# Altium schematic sheet VCO_Esquematico.SchDoc
size A4
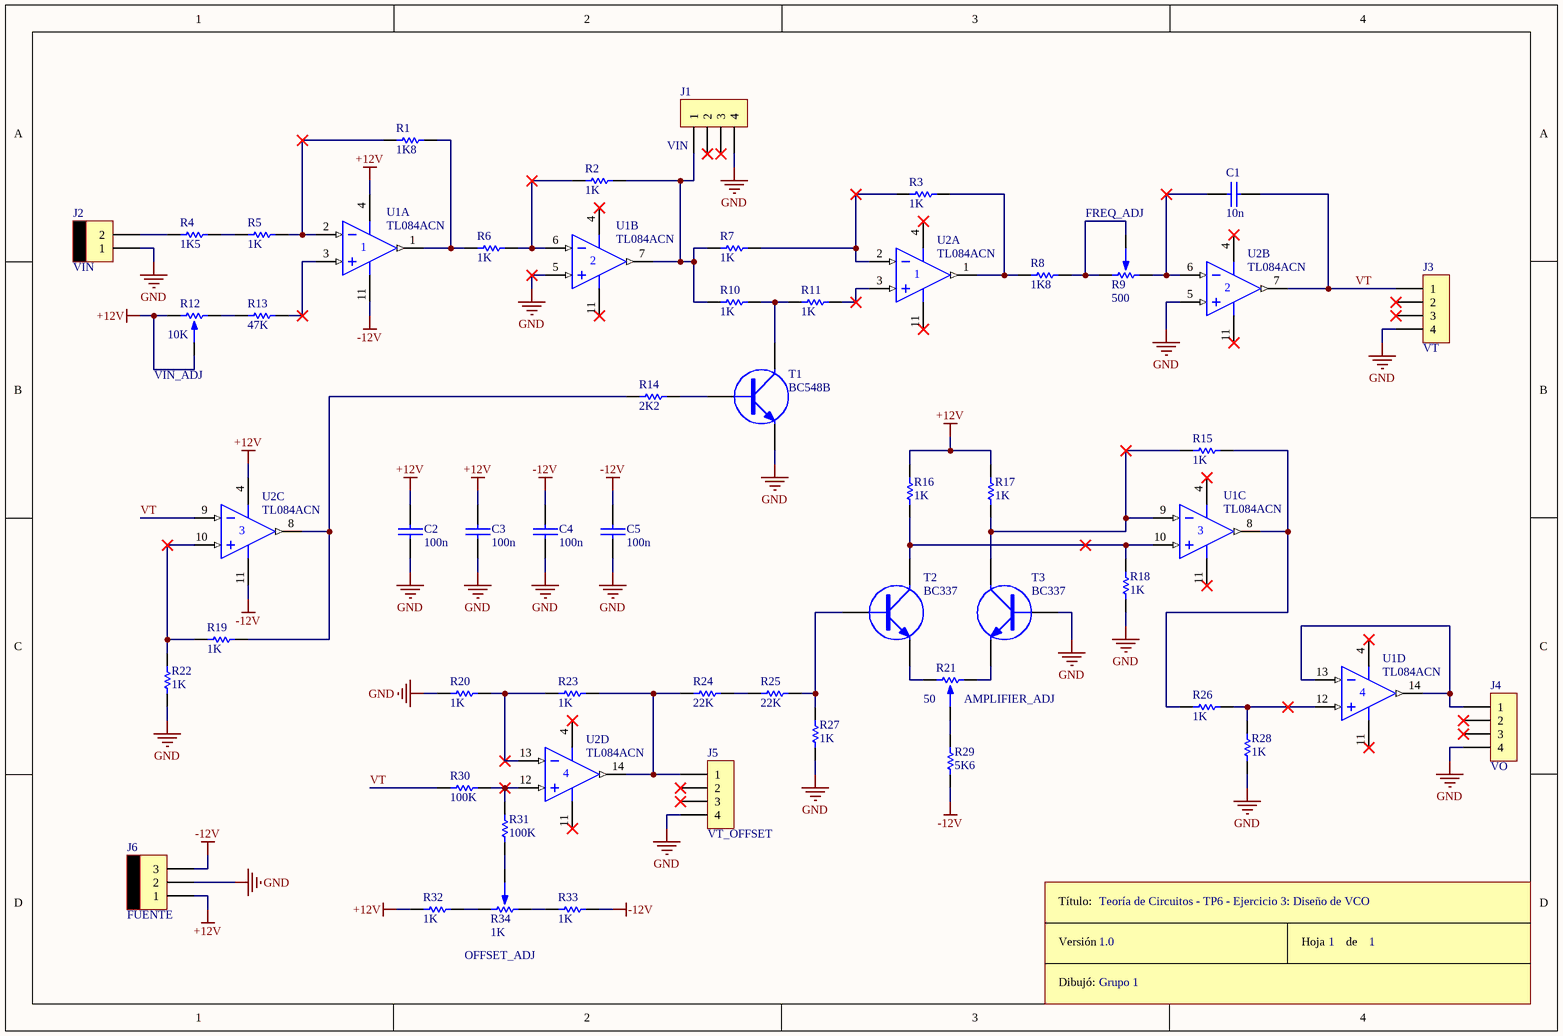
[diagram p0: VCO_Esquematico.SchDoc]

## Parts
C1  10n  [CAP100]
C2  100n  [CAP100]
C3  100n  [CAP100]
C4  100n  [CAP100]
C5  100n  [CAP100]
J1  VIN  [SIP4]
J2  VIN  [MOLEX2]
J3  VT  [SIP4]
J4  VO  [SIP4]
J5  VT_OFFSET  [SIP4]
J6  FUENTE  [MOLEX3]
R1  1K8  [RES300]
R2  1K  [RES300]
R3  1K  [RES300]
R4  1K5  [RES300]
R5  1K  [RES300]
R6  1K  [RES300]
R7  1K  [RES300]
R8  1K8  [RES300]
R9  500  [PRESET V]
R10  1K  [RES300]
R11  1K  [RES300]
R12  10K  [PRESET V]
R13  47K  [RES300]
R14  2K2  [RES300]
R15  1K  [RES300]
R16  1K  [RES300]
R17  1K  [RES300]
R18  1K  [RES300]
R19  1K  [RES300]
R20  1K  [RES300]
R21  50  [PRESET V]
R22  1K  [RES300]
R23  1K  [RES300]
R24  22K  [RES300]
R25  22K  [RES300]
R26  1K  [RES300]
R27  1K  [RES300]
R28  1K  [RES300]
R29  5K6  [RES300]
R30  100K  [RES300]
R31  100K  [RES300]
R32  1K  [RES300]
R33  1K  [RES300]
R34  1K  [PRESET V]
ROT1  Rótulo  (value not drawn)
T1  BC548B  [TO92]
T2  BC337  [TO92]
T3  BC337  [TO92]
U1  TL084ACN  [646-06]  (parts A,B,C,D of 4)
U2  TL084ACN  [646-06]  (parts A,B,C,D of 4)

## Nets
+12V: C2.1 C3.1 J6.1 R12.2 R12.3 R16.2 R17.2 R32.1 U1.4(V+) U2.4(V+)
-12V: C4.1 C5.1 J6.3 R29.1 R33.2 U1.11(V-) U2.11(V-)
GND: C2.2 C3.2 C4.2 C5.2 J1.4 J2.1 J3.4 J4.4 J5.4 J6.2 R18.1 R20.2 R22.1 R27.2 R28.1 T1.3(E) T3.1(B) U1.5(IN+) U2.5(IN+)
VT: C1.2 J3.1 R30.1 U2.7(OUT) U2.9(IN-)
NetC1_1: C1.1 R9.3 U2.6(IN-)
NetJ1_1: J1.1 R2.2 R7.1 R10.1 U1.7(OUT)
NetJ2_2: J2.2 R4.1
NetJ4_1: J4.1 U1.13(IN-) U1.14(OUT)
NetJ5_1: J5.1 R23.2 R24.2 U2.14(OUT)
NetR1_1: R1.1 R5.2 U1.2(IN-)
NetR1_2: R1.2 R6.1 U1.1(OUT)
NetR2_1: R2.1 R6.2 U1.6(IN-)
NetR3_1: R3.1 R7.2 U2.2(IN-)
NetR3_2: R3.2 R8.1 U2.1(OUT)
NetR4_2: R4.2 R5.1
NetR8_2: R8.2 R9.1 R9.2
NetR10_2: R10.2 R11.1 T1.2(C)
NetR11_2: R11.2 U2.3(IN+)
NetR12_1: R12.1 R13.1
NetR13_2: R13.2 U1.3(IN+)
NetR14_1: R14.1 R19.2 U2.8(OUT)
NetR14_2: R14.2 T1.1(B)
NetR15_1: R15.1 R17.1 T3.2(C) U1.9(IN-)
NetR15_2: R15.2 R26.2 U1.8(OUT)
NetR16_1: R16.1 R18.2 T2.2(C) U1.10(IN+)
NetR19_1: R19.1 R22.2 U2.10(IN+)
NetR20_1: R20.1 R23.1 U2.13(IN-)
NetR21_1: R21.1 T3.3(E)
NetR21_2: R21.2 R29.2
NetR21_3: R21.3 T2.3(E)
NetR24_1: R24.1 R25.1
NetR25_2: R25.2 R27.1 T2.1(B)
NetR26_1: R26.1 R28.2 U1.12(IN+)
NetR30_2: R30.2 R31.2 U2.12(IN+)
NetR31_1: R31.1 R34.2
NetR32_2: R32.2 R34.1
NetR33_1: R33.1 R34.3

Not connected (* = marked no-connect by the designer): J1 2* 3*; J3 2* 3*; J4 2* 3*; J5 2* 3*

## Notes on the sheet
- (near R9) FREQ_ADJ
- (near R12) VIN_ADJ
- (near R21) AMPLIFIER_ADJ
- Teoría de Circuitos - TP6 - Ejercicio 3: Diseño de VCO
- OFFSET_ADJ
- 1.0
- Grupo 1
- 1
- (in symbol Rótulo) Título:; Versión; Hoja       de; Dibujó:

## Library data of the parts
C1-C5 = CAP
J1 J3-J5 = CON4
J2 = MOLEX2
J6 = MOLEX3
R1-R8 R10 R11 R13-R20 R22-R33 = RES
R9 R12 R21 R34 = PRESET
T1-T3 = TRANSISTOR NPN
U1 U2 = TL084ACN: JFET-Input Operational Amplifier; Published: 17-Jul-2002; LatestRevisionDate: 06-Jun-2005; LatestRevisionNote: Stylized 3D Model Added.; DatasheetVersion: 1988; PackageVersion: 1997; PackageReference: 646-06; Publisher: Altium Limited; PackageDescription: DIP; 14 Leads; Row Spacing 7.62 mm; Pitch 2.54 mm; ComponentLink1Description: Manufacturer Link; ComponentLink1URL: http://www.onsemi.com/site/products/parametrics/0,4446,251,00.html